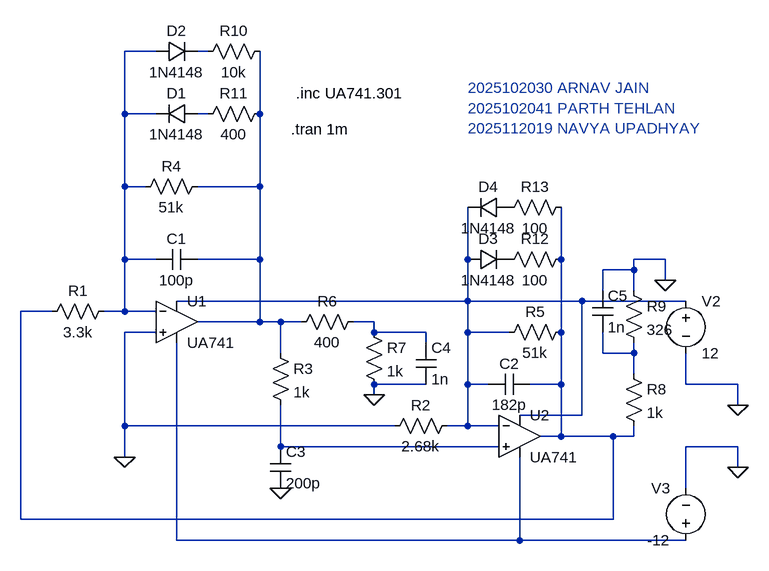
[diagram p0: schematic quadrature_oscillator.asc]
quadrature_oscillator.asc, the LTspice schematic file:
Version 4.1
SHEET 1 1028 680
WIRE -1072 -560 -1120 -560
WIRE -992 -560 -1008 -560
WIRE -1120 -464 -1120 -560
WIRE -1072 -464 -1120 -464
WIRE -992 -464 -1008 -464
WIRE -912 -464 -912 -560
WIRE -1120 -352 -1120 -464
WIRE -1088 -352 -1120 -352
WIRE -912 -352 -912 -464
WIRE -912 -352 -1008 -352
WIRE -1120 -240 -1120 -352
WIRE -1072 -240 -1120 -240
WIRE -912 -240 -912 -352
WIRE -912 -240 -1008 -240
WIRE -592 -240 -592 -320
WIRE -448 -240 -448 -320
WIRE -288 -240 -336 -240
WIRE -336 -224 -336 -240
WIRE -336 -224 -384 -224
WIRE -288 -208 -288 -240
WIRE -384 -192 -384 -224
WIRE -336 -192 -336 -224
WIRE -592 -176 -592 -240
WIRE -592 -176 -1040 -176
WIRE -416 -176 -592 -176
WIRE -256 -176 -416 -176
WIRE -1232 -160 -1280 -160
WIRE -1120 -160 -1120 -240
WIRE -1120 -160 -1152 -160
WIRE -1072 -160 -1120 -160
WIRE -912 -144 -912 -240
WIRE -912 -144 -1008 -144
WIRE -880 -144 -912 -144
WIRE -848 -144 -880 -144
WIRE -736 -144 -768 -144
WIRE -1072 -128 -1120 -128
WIRE -736 -128 -736 -144
WIRE -656 -128 -736 -128
WIRE -592 -128 -592 -176
WIRE -528 -128 -592 -128
WIRE -448 -128 -448 -240
WIRE -656 -112 -656 -128
WIRE -880 -96 -880 -144
WIRE -384 -96 -384 -128
WIRE -336 -96 -336 -112
WIRE -336 -96 -384 -96
WIRE -336 -64 -336 -96
WIRE -656 -48 -736 -48
WIRE -592 -48 -592 -128
WIRE -560 -48 -592 -48
WIRE -448 -48 -448 -128
WIRE -448 -48 -496 -48
WIRE -256 -48 -256 -96
WIRE -176 -48 -256 -48
WIRE -736 -32 -736 -48
WIRE -176 -16 -176 -48
WIRE -416 0 -416 -176
WIRE -416 0 -512 0
WIRE -1120 16 -1120 -128
WIRE -704 16 -1120 16
WIRE -592 16 -592 -48
WIRE -592 16 -624 16
WIRE -544 16 -592 16
WIRE -448 32 -448 -48
WIRE -448 32 -480 32
WIRE -368 32 -448 32
WIRE -336 32 -336 16
WIRE -336 32 -368 32
WIRE -880 48 -880 -16
WIRE -544 48 -880 48
WIRE -176 48 -256 48
WIRE -1120 64 -1120 16
WIRE -176 80 -176 48
WIRE -256 112 -256 48
WIRE -1280 160 -1280 -160
WIRE -368 160 -368 32
WIRE -368 160 -1280 160
WIRE -1040 192 -1040 -112
WIRE -512 192 -512 64
WIRE -512 192 -1040 192
WIRE -256 192 -512 192
FLAG -880 112 0
FLAG -176 -16 0
FLAG -176 80 0
FLAG -1120 64 0
FLAG -288 -208 0
FLAG -736 -32 0
SYMBOL OpAmps\\opamp2 -1040 -208 R0
SYMATTR InstName U1
SYMATTR Value UA741
SYMBOL OpAmps\\opamp2 -512 -32 R0
SYMATTR InstName U2
SYMATTR Value UA741
SYMBOL res -1136 -176 R90
WINDOW 0 0 56 VBottom 2
WINDOW 3 32 56 VTop 2
SYMATTR InstName R1
SYMATTR Value 3.3k
SYMBOL res -608 0 R90
WINDOW 0 0 56 VBottom 2
WINDOW 3 32 56 VTop 2
SYMATTR InstName R2
SYMATTR Value 2.68k
SYMBOL cap -1008 -256 R90
WINDOW 0 0 32 VBottom 2
WINDOW 3 32 32 VTop 2
SYMATTR InstName C1
SYMATTR Value 100p
SYMBOL cap -496 -64 R90
WINDOW 0 0 32 VBottom 2
WINDOW 3 32 32 VTop 2
SYMATTR InstName C2
SYMATTR Value 182p
SYMBOL res -896 -112 R0
SYMATTR InstName R3
SYMATTR Value 1k
SYMBOL cap -896 48 R0
SYMATTR InstName C3
SYMATTR Value 200p
SYMBOL voltage -256 -192 R0
WINDOW 123 0 0 Left 0
WINDOW 39 0 0 Left 0
SYMATTR InstName V2
SYMATTR Value 12
SYMBOL voltage -256 208 R180
WINDOW 0 24 96 Left 2
WINDOW 3 24 16 Left 2
WINDOW 123 0 0 Left 0
WINDOW 39 0 0 Left 0
SYMATTR InstName V3
SYMATTR Value -12
SYMBOL diode -1008 -480 R90
WINDOW 0 0 32 VBottom 2
WINDOW 3 32 32 VTop 2
SYMATTR InstName D1
SYMATTR Value 1N4148
SYMBOL diode -1072 -544 R270
WINDOW 0 32 32 VTop 2
WINDOW 3 0 32 VBottom 2
SYMATTR InstName D2
SYMATTR Value 1N4148
SYMBOL diode -592 -224 R270
WINDOW 0 32 32 VTop 2
WINDOW 3 0 32 VBottom 2
SYMATTR InstName D3
SYMATTR Value 1N4148
SYMBOL diode -528 -336 R90
WINDOW 0 0 32 VBottom 2
WINDOW 3 32 32 VTop 2
SYMATTR InstName D4
SYMATTR Value 1N4148
SYMBOL res -992 -368 R90
WINDOW 0 0 56 VBottom 2
WINDOW 3 32 56 VTop 2
SYMATTR InstName R4
SYMATTR Value 51k
SYMBOL res -432 -144 R90
WINDOW 0 0 56 VBottom 2
WINDOW 3 32 56 VTop 2
SYMATTR InstName R5
SYMATTR Value 51k
SYMBOL res -752 -160 R90
WINDOW 0 0 56 VBottom 2
WINDOW 3 32 56 VTop 2
SYMATTR InstName R6
SYMATTR Value 400
SYMBOL res -752 -144 R0
SYMATTR InstName R7
SYMATTR Value 1k
SYMBOL res -352 -80 R0
SYMATTR InstName R8
SYMATTR Value 1k
SYMBOL res -352 -208 R0
SYMATTR InstName R9
SYMATTR Value 326
SYMBOL cap -672 -112 R0
SYMATTR InstName C4
SYMATTR Value 1n
SYMBOL cap -400 -192 R0
SYMATTR InstName C5
SYMATTR Value 1n
SYMBOL res -896 -576 R90
WINDOW 0 0 56 VBottom 2
WINDOW 3 32 56 VTop 2
SYMATTR InstName R10
SYMATTR Value 10k
SYMBOL res -896 -480 R90
WINDOW 0 0 56 VBottom 2
WINDOW 3 32 56 VTop 2
SYMATTR InstName R11
SYMATTR Value 400
SYMBOL res -432 -256 R90
WINDOW 0 0 56 VBottom 2
WINDOW 3 32 56 VTop 2
SYMATTR InstName R12
SYMATTR Value 100
SYMBOL res -432 -336 R90
WINDOW 0 0 56 VBottom 2
WINDOW 3 32 56 VTop 2
SYMATTR InstName R13
SYMATTR Value 100
TEXT -856 -496 Left 2 !.inc UA741.301
TEXT -864 -440 Left 2 !.tran 1m
TEXT -592 -504 Left 2 ;2025102030 ARNAV JAIN\n2025102041 PARTH TEHLAN\n2025112019 NAVYA UPADHYAY

The netlist it stands for:
* quadrature_oscillator.asc
X§U1 0 N001 N005 N010 N004 UA741  ; pins In+ In- V+ V- OUT
X§U2 N009 N005 N005 N010 N006 UA741  ; pins In+ In- V+ V- OUT
R1 N001 N006 3.3k
R2 N005 0 2.68k
C1 N004 N001 100p
C2 N006 N005 182p
R3 N004 N009 1k
C3 N009 0 200p
V2 N005 0 12
V3 N010 0 -12
D1 N003 N001 1N4148
D2 N001 N002 1N4148
D3 N005 P001 1N4148
D4 P002 N005 1N4148
R4 N004 N001 51k
R5 N006 N005 51k
R6 N007 N004 400
R7 N007 0 1k
R8 N008 N006 1k
R9 0 N008 326
C4 N007 0 1n
C5 0 N008 1n
R10 N004 N002 10k
R11 N004 N003 400
R12 N006 P001 100
R13 N006 P002 100
.model D D
.lib standard.dio
.inc UA741.301
.tran 1m
* 2025102030 ARNAV JAIN
* 2025102041 PARTH TEHLAN
* 2025112019 NAVYA UPADHYAY
.backanno
.end